# Altium schematic sheet 3V3 SMPS.SchDoc
size A; SheetNumber: 4; SheetTotal: 4
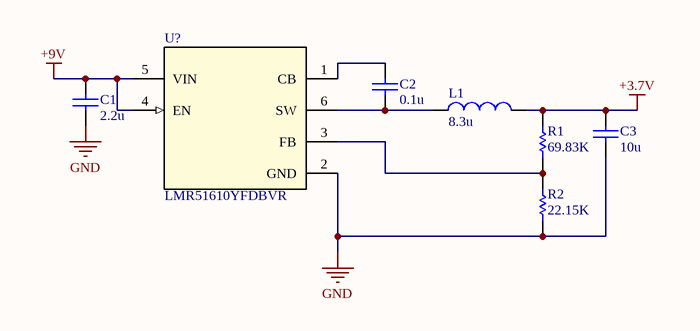
[diagram p0: 3V3 SMPS.SchDoc]

## Parts
C1  value 2.2u  (hidden comment: Capacitor)
C2  value 0.1u  (hidden comment: Capacitor)
C3  value 10u  (hidden comment: Capacitor)
L1  value 8.3u  (hidden comment: Inductor)
R1  value 69.83K  (hidden comment: Resistor)
R2  value 22.15K  (hidden comment: Resistor)
U?  LMR51610YFDBVR  [DBV0006A-IPC_A]

## Nets
+3.7V: C3.2 L1.2 R1.2
+9V: C1.2 U?.4(EN) U?.5(VIN)
GND: C1.1 C3.1 R2.1 U?.2(GND)
NetC2_1: C2.1 L1.1 U?.6(SW)
NetC2_2: C2.2 U?.1(CB)
NetR1_1: R1.1 R2.2 U?.3(FB)

## Library data of the parts
C1-C3 = Capacitor: SimulationGenericComponent: True
L1 = Inductor: SimulationGenericComponent: True
R1 R2 = Resistor: TC1: 0; SimulationGenericComponent: True; TC2: 0
U? = LMR51610YFDBVR: No Description Available; Mfr_Name: Texas Instruments; TYPE: TYPE; RefDes: RefDes